# EAGLE design Schematic (EAGLE 9.1.1)
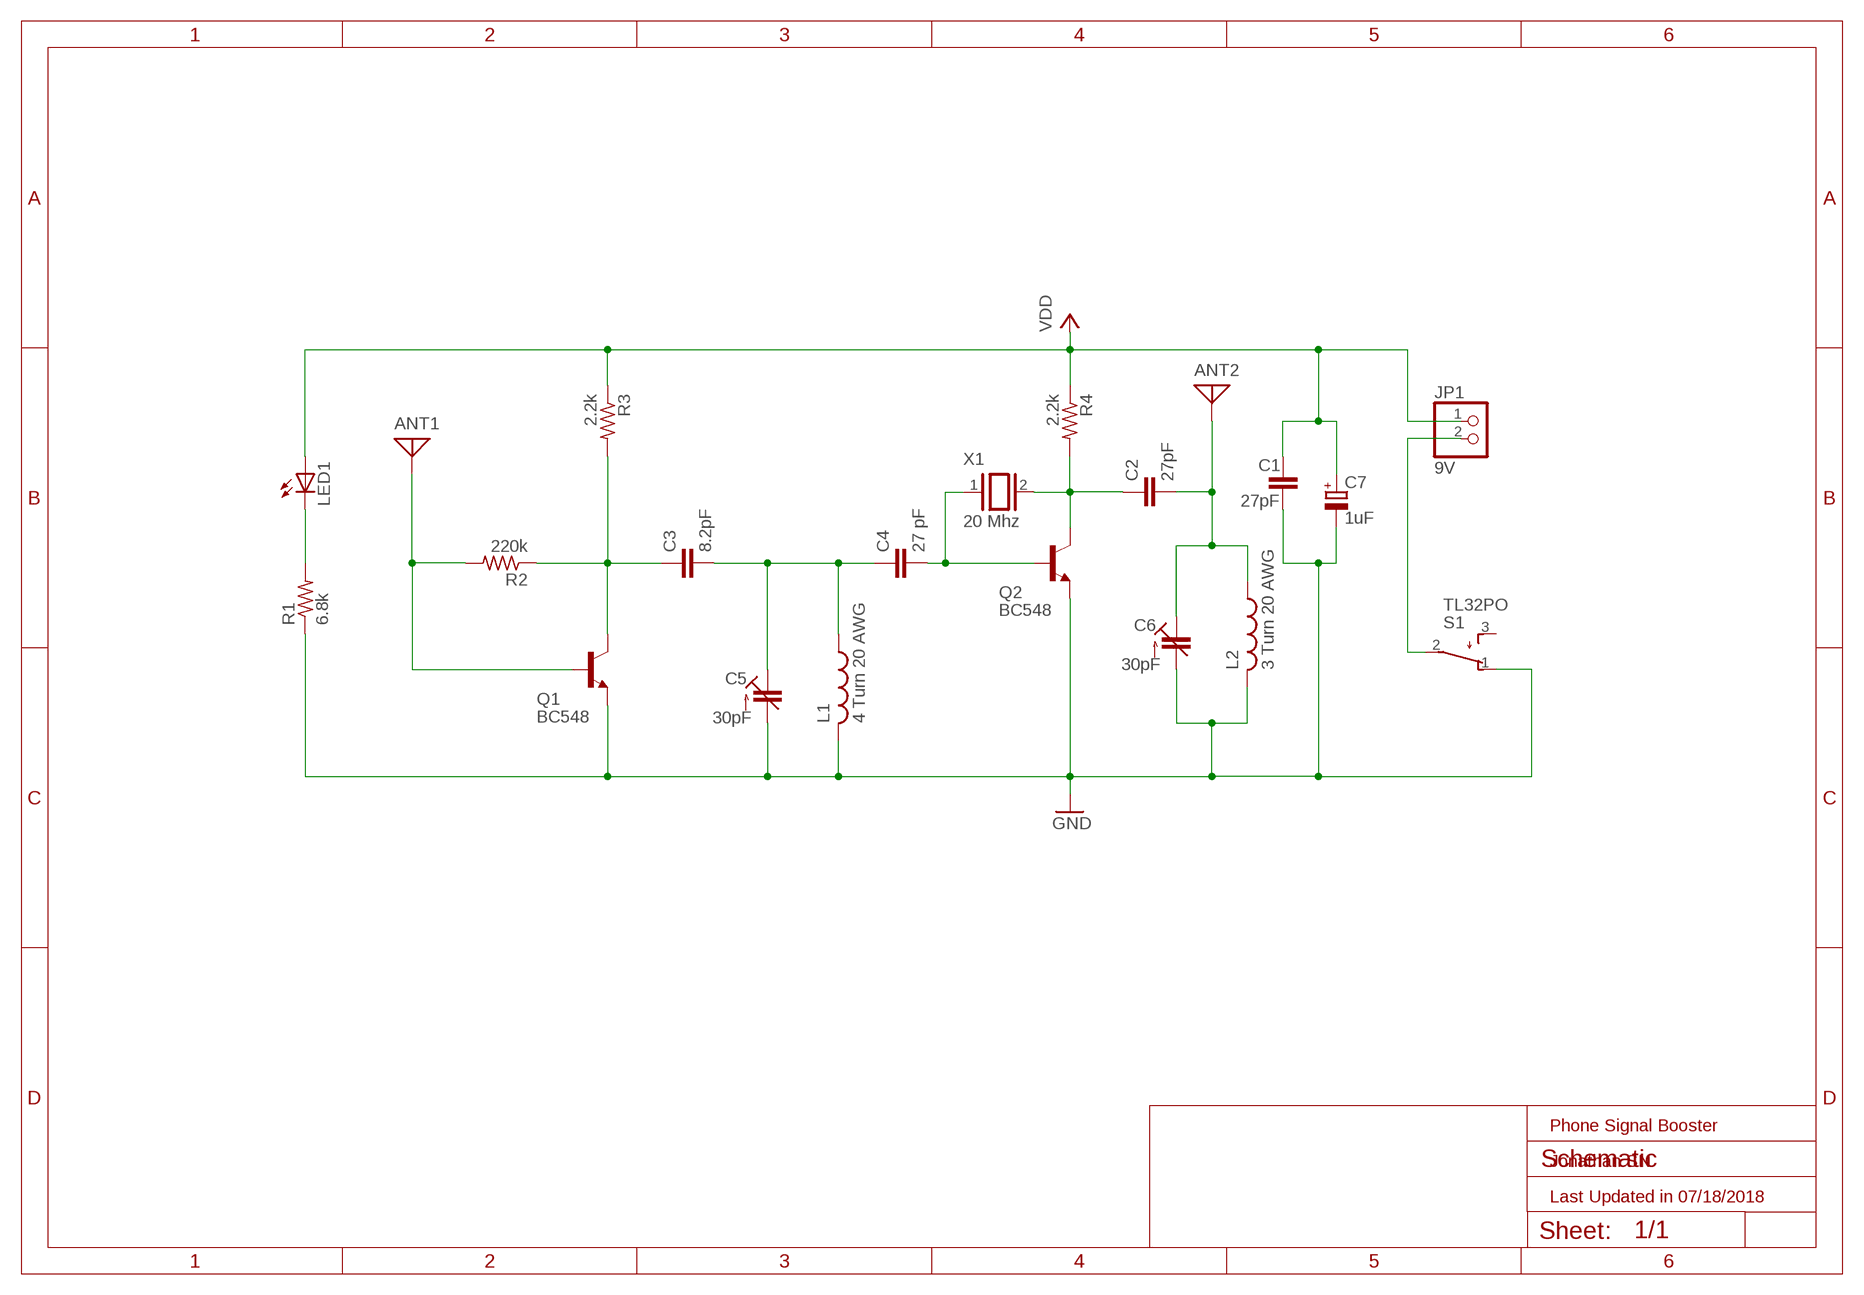
[diagram p0: schematic, sheet 1]

## Parts
ANT1  ANTENNA  [PAD-01]
ANT2  ANTENNA  [PAD-01]
C1  27pF  C2,5-3  [C2.5-3]
C2  27pF  C2,5-3  [C2.5-3]
C3  8.2pF  C2,5-3  [C2.5-3]
C4  27 pF  C2,5-3  [C2.5-3]
C5  30pF  C-TRIMM808  [CTRIM808-BC]
C6  30pF  C-TRIMM808  [CTRIM808-BC]
C7  1uF  CPOL-EUE2-5  [E2-5]
JP1  9V  PINHD-1X2  [1X02]
L1  4 Turn 20 AWG  L-US0204/5  [0204/5]
L2  3 Turn 20 AWG  L-US0204/5  [0204/5]
LED1  LED3MM  [LED3MM]
Q1  BC548  [TO92-EBC]
Q2  BC548  [TO92-EBC]
R1  6.8k  R-US_0207/7  [0207/7]
R2  220k  R-US_0207/7  [0207/7]
R3  2.2k  R-US_0207/7  [0207/7]
R4  2.2k  R-US_0207/7  [0207/7]
S1  TL32PO  [TL3XPO]
X1  20 Mhz  XTAL/S  [QS]

## Nets
ANT1: ANT1.1 Q1.B R2.2
ANT2: ANT2.1 C2.2 C6.1(E) L2.1
BAT-: JP1.2 S1.2(P)
CRYSTAL1: C4.2 Q2.B X1.1
CRYSTAL2: C2.1 Q2.C R4.2 X1.2
GND: C1.2 C5.2(A) C6.2(A) C7.- L1.2 L2.2 Q1.E Q2.E R1.1 S1.1(O)
L4TURN: C3.2 C4.1 C5.1(E) L1.1
LED-: LED1.K(C) R1.2
N$6: C3.1 Q1.C R2.1 R3.2
VDD: C1.1 C7.+ JP1.1 LED1.A R3.1 R4.1
Unconnected: S1.3(S)

## Notes on the sheet
- Phone Signal Booster
- Jonathan SN
- Last Updated in 07/18/2018

## Library data of the parts
ANT1 ANT2 = discrete:ANTENNA: Antenna
C1-C4 = capacitor-wima:C: CAPACITOR naming: grid - package width
C5 C6 = resistor:C-TRIMM: Trimm capacitor
C7 = resistor:CPOL-EU: POLARIZED CAPACITOR, European symbol
JP1 = pinhead:PINHD-1X2: PIN HEADER
L1 L2 = rcl:L-US: INDUCTOR, American symbol; SPICEPREFIX: L
LED1 = led:LED: LED OSRAM: - CHIPLED LG R971, LG N971, LY N971, LG Q971, LY Q971, LO R971, LY R971 LH N974, LH R974 LS Q976, LO Q976, LY Q976 LO Q996 - Hyper CHIPLED LW Q18S LB Q993, LB Q99A, LB R99A - SideLED LS A670, LO A670, LY A670, LG A670, LP A670 LB A673, LV A673, LT A673, LW A673 LH A674 LY A675 LS A676, LA A676, LO A676, LY A676, LW A676 LS A679, LY A679, LG A679 - Hyper Micro SIDELED® LS Y876, LA Y876, LO Y876, LY Y876 LT Y87S - SmartLED LW L88C, LW L88S LB L89C, LB L89S, LG L890 LS L89K, LO L89K, LY L89K LS L896, LA L896, LO L896, LY L896 - TOPLED LS T670, LO T670, LY T670, LG T670, LP T670 LSG T670, LSP T670, LSY T670, LOP T670, LYG T670 LG T671, LOG T671, LSG T671 LB T673, LV T673, LT T673, LW T673 LH T674 LS T676, LA T676, LO T676, LY T676, LB T676, LH T676, LSB T676, LW T676 LB T67C, LV T67C, LT T67C, LS T67K, LO T67K, LY T67K, LW E67C LS E67B, LA E67B, LO E67B, LY E67B, LB E67C, LV E67C, LT E67C LW T67C LS T679, LY T679, LG T679 LS T770, LO T770, LY T770, LG T770, LP T770 LB T773, LV T773, LT T773, LW T773 LH T774 LS E675, LA E675, LY E675, LS T675 LS T776, LA T776, LO T776, LY T776, LB T776 LHGB T686 LT T68C, LB T68C - Hyper Mini TOPLED® LB M676 - Mini TOPLED Santana® LG M470 LS M47K, LO M47K, LY M47K Source: http://www.osram.convergy.de LUXEON: - LUMILED® LXK2-PW12-R00, LXK2-PW12-S00, LXK2-PW14-U00, LXK2-PW14-V00 LXK2-PM12-R00, LXK2-PM12-S00, LXK2-PM14-U00 LXK2-PE12-Q00, LXK2-PE12-R00, LXK2-PE12-S00, LXK2-PE14-T00, LXK2-PE14-U00 LXK2-PB12-K00, LXK2-PB12-L00, LXK2-PB12-M00, LXK2-PB14-N00, LXK2-PB14-P00, LXK2-PB14-Q00 LXK2-PR12-L00, LXK2-PR12-M00, LXK2-PR14-Q00, LXK2-PR14-R00 LXK2-PD12-Q00, LXK2-PD12-R00, LXK2-PD12-S00 LXK2-PH12-R00, LXK2-PH12-S00 LXK2-PL12-P00, LXK2-PL12-Q00, LXK2-PL12-R00 Source: www.luxeon.com KINGBRIGHT: KA-3528ASYC Source: www.kingbright.com
Q1 Q2 = transistor-npn:BC548*: NPN Transistor
R1-R4 = resistor:R-US_: RESISTOR, American symbol
S1 = switch:TL32PO: TINY SWITCH ON - MOM Source: http://www2.produktinfo.conrad.com/datenblaetter/700000-724999/705152-da-01-de-Subminiaturschalter_TL_36YO.pdf
X1 = special:XTAL/S: CRYSTAL

## Board
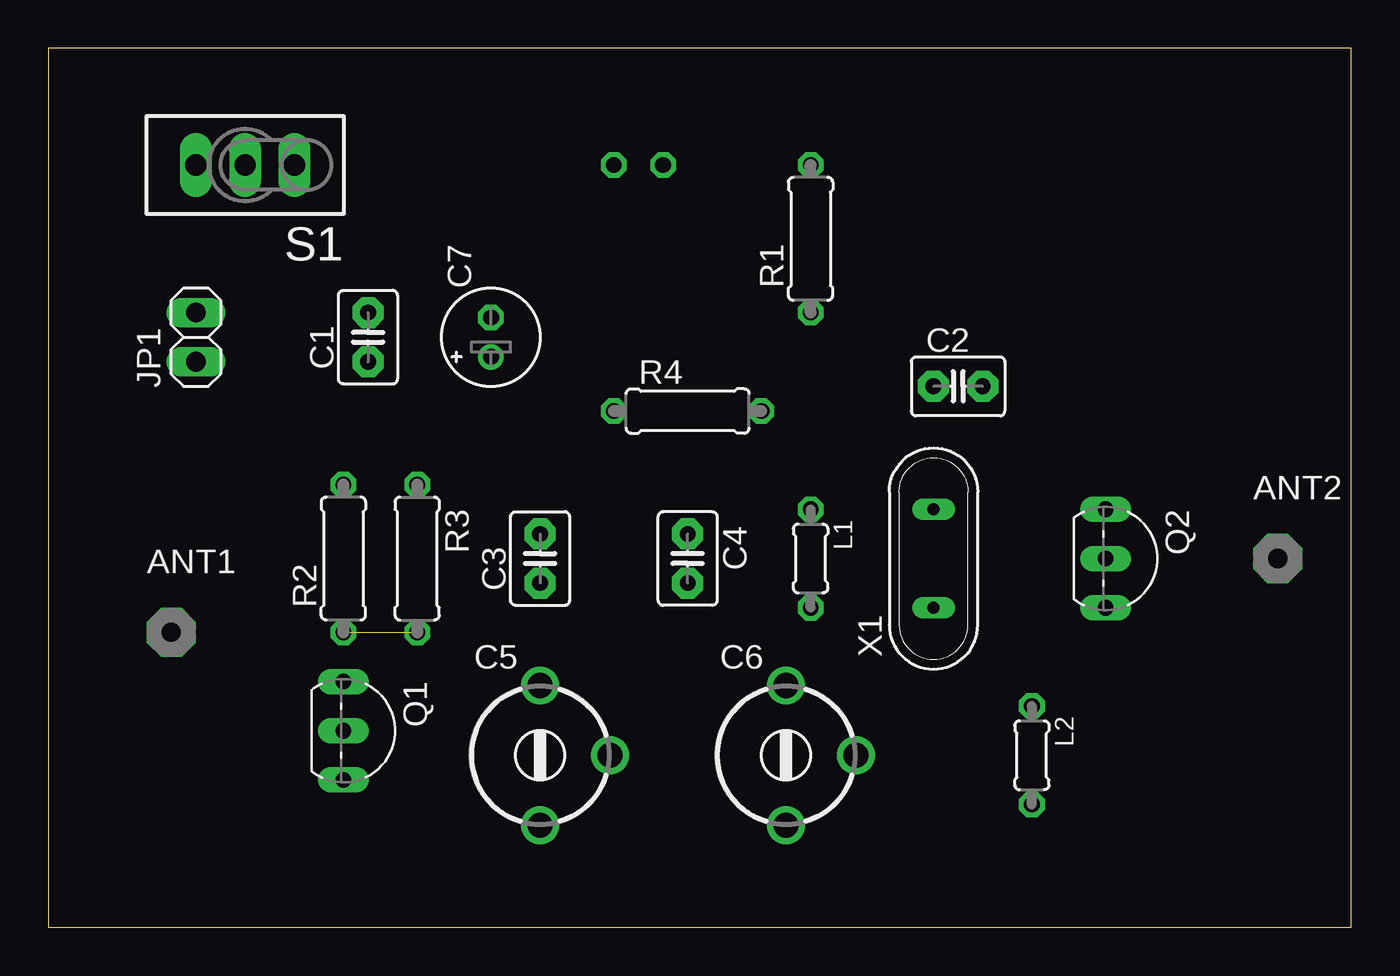
[diagram p1: board, top side]
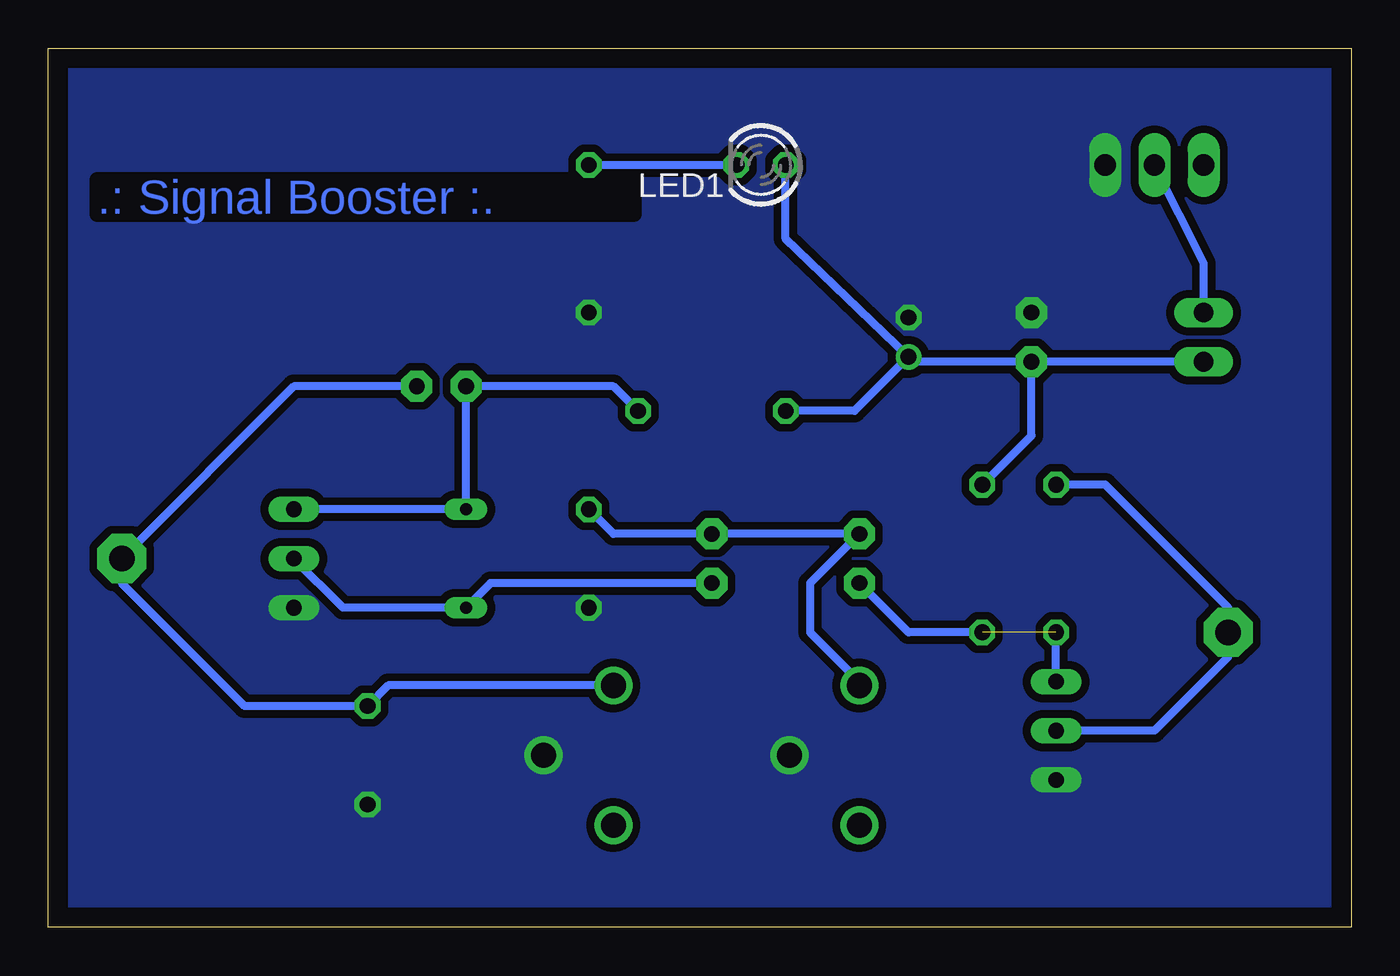
[diagram p2: board, bottom side, seen from below]

Size 67.29 x 45.39 mm. Coordinates in mm from the lower left corner, seen from the top.
Outline: 0,0 67.29,0 67.29,45.39 0,45.39 0,0
Copper layers (1*16): Top 0.035mm / dielectric 1.5mm / Bottom 0.035mm
Design rules "default": minimum track width 6mil, minimum drill 0.35mm, track to track 6mil, track to pad 6mil, pad to pad 6mil, via to via 6mil, smd to smd 6mil, copper to edge 40mil, drill to drill 6mil, minimum pad ring 10mil, minimum via ring 8mil, stop-mask expansion 4mil, vias tented up to drill 0mil, thermal gap 10mil

### Footprints (pad centres in the part's own frame; a part is rotated, then mirrored left to right if it is on the bottom)
PAD-01 = drill 1.321 pad 2.54 octagon: 1 0,0
C2.5-3 = drill 0.813 pad 1.6 octagon: 1 -1.27,0; 2 1.27,0
CTRIM808-BC = drill 1.3: 1 -3.607,0; 2 0,3.607; 3 3.607,0
E2-5 = drill 0.813 pad 1.27: + -1.016,0 | drill 0.813 pad 1.27 octagon: - 1.016,0
1X02 = drill 1.016 long: 1 -1.27,0; 2 1.27,0
0204/5 = drill 0.813 octagon: 1 -2.54,0; 2 2.54,0
LED3MM = drill 0.813 octagon: A -1.27,0; K 1.27,0
TO92-EBC = drill 0.813 long: B 0,-1.27; C -2.54,-1.27; E 2.54,-1.27
0207/7 = drill 0.813 octagon: 1 -3.81,0; 2 3.81,0
TL3XPO = drill 1.1 pad 1.422 long: 1 -2.54,0; 2 0,0; 3 2.54,0
QS = drill 0.61 long: 1 -2.54,0; 2 2.54,0

### Placement (x,y rotation side)
ANT1  6.35,15.24 0 top
ANT2  63.5,19.05 0 top
C1  16.51,30.48 90 top
C2  46.99,27.94 0 top
C3  25.4,19.05 90 top
C4  33.02,19.05 270 top
C5  25.4,8.89 270 top
C6  38.1,8.89 270 top
C7  22.86,30.48 90 top
JP1  7.62,30.48 90 top
L1  39.37,19.05 270 top
L2  50.8,8.89 270 top
LED1  30.48,39.37 180 bottom
Q1  16.51,10.16 270 top
Q2  55.88,19.05 270 top
R1  39.37,35.56 90 top
R2  15.24,19.05 90 top
R3  19.05,19.05 270 top
R4  33.02,26.67 0 top
S1  10.16,39.37 180 top
X1  45.72,19.05 90 top

### Tracks (layer width: path | path; a pad name or v marks a point on that pad's centre or on a via)
ANT1
  Bottom 0.406: R2.2 12.7,22.86 6.35,16.51 ANT1.1 6.35,13.97 10.16,10.16 Q1.B
ANT2
  Bottom 0.406: C2.2 54.61,27.94 ANT2.1 63.5,17.78 57.15,11.43 L2.1 49.73,12.5 C6.1
BAT-
  Bottom 0.406: JP1.2 7.62,34.29 S1.2
CRYSTAL1
  Bottom 0.406: C4.2 44.45,17.78 X1.1 52.07,16.51 Q2.B
CRYSTAL2
  Bottom 0.406: R4.2 38.1,27.94 C2.1 X1.2 Q2.C
GND
  Bottom 0.406: 22.61,31.75 C7.- | C5.2 29.21,8.89
  pour Bottom (isolate 0.406, no thermals): 0,45.72 0,0 67.31,0 67.31,45.72
L4TURN
  Bottom 0.406: L1.1 38.1,20.32 C4.1 C3.2 27.94,17.78 27.94,15.24 25.4,12.7 C5.1
LED-
  Bottom 0.406: LED1.K R1.2
N$6  (1 unrouted)
  Bottom 0.406: R3.2 22.86,15.24 C3.1 | Q1.C R2.1
VDD
  Bottom 0.406: JP1.1 C1.1 | R3.1 16.51,25.4 C1.1 | C1.1 22.61,29.21 C7.+ | C7.+ 29.21,35.56 LED1.A | C7.+ 25.65,26.67 R4.1

### Text on the board
Bottom: .: Signal Booster :.